# EAGLE design Alim-5-12vcc (EAGLE 7.2.0)
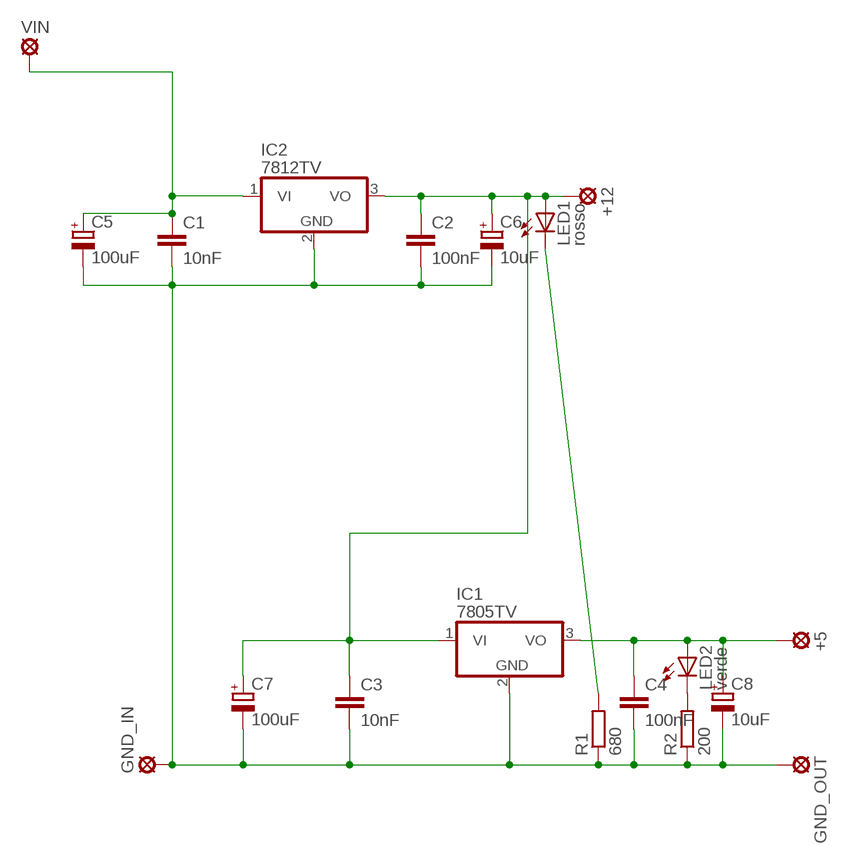
[diagram p0: schematic, sheet 1]

## Parts
+5  SE14  [SE14]
+12  SE14  [SE14]
C1  10nF  C-EU050-025X075  [C050-025X075]
C2  100nF  C-EU050-025X075  [C050-025X075]
C3  10nF  C-EU050-025X075  [C050-025X075]
C4  100nF  C-EU050-025X075  [C050-025X075]
C5  100uF  CPOL-EUE2.5-6  [E2,5-6]
C6  10uF  CPOL-EUE2.5-6  [E2,5-6]
C7  100uF  CPOL-EUE2.5-6  [E2,5-6]
C8  10uF  CPOL-EUE2.5-6  [E2,5-6]
GND_IN  SE14  [SE14]
GND_OUT  SE14  [SE14]
IC1  7805TV  [TO220V]
IC2  7812TV  [TO220V]
LED1  rosso  LED5MM  [LED5MM]
LED2  verde  LED5MM  [LED5MM]
R1  680  R-EU_0204/7  [0204/7]
R2  200  R-EU_0204/7  [0204/7]
VIN  SE14  [SE14]

## Nets
N$1: C1.1 C5.+ IC2.1(VI) VIN.MP
N$2: +12.MP C2.1 C3.1 C6.+ C7.+ IC1.1(VI) IC2.3(VO) LED1.A
N$3: C1.2 C2.2 C3.2 C4.2 C5.- C6.- C7.- C8.- GND_IN.MP GND_OUT.MP IC1.2(GND) IC2.2(GND) R1.1 R2.1
N$4: LED1.K(C) R1.2
N$5: +5.MP C4.1 C8.+ IC1.3(VO) LED2.A
N$6: LED2.K(C) R2.2

## Library data of the parts
+5 +12 GND_IN GND_OUT VIN = solpad:SE14: SOLDER PAD E1553, drill 1,4mm, distributor Buerklin, 07F820
C1-C4 = resistor:C-EU: CAPACITOR, European symbol
C5-C8 = resistor:CPOL-EU: POLARIZED CAPACITOR, European symbol
IC1 IC2 = linear:78*: Positive VOLTAGE REGULATOR Source: http://cache.national.com/ds/LM/LM78L05.pdf http://www.fairchildsemi.com/ds/LM/LM7805.pdf
LED1 LED2 = led:LED: LED OSRAM: - CHIPLED LG R971, LG N971, LY N971, LG Q971, LY Q971, LO R971, LY R971 LH N974, LH R974 LS Q976, LO Q976, LY Q976 LO Q996 - Hyper CHIPLED LW Q18S LB Q993, LB Q99A, LB R99A - SideLED LS A670, LO A670, LY A670, LG A670, LP A670 LB A673, LV A673, LT A673, LW A673 LH A674 LY A675 LS A676, LA A676, LO A676, LY A676, LW A676 LS A679, LY A679, LG A679 - Hyper Micro SIDELED® LS Y876, LA Y876, LO Y876, LY Y876 LT Y87S - SmartLED LW L88C, LW L88S LB L89C, LB L89S, LG L890 LS L89K, LO L89K, LY L89K LS L896, LA L896, LO L896, LY L896 - TOPLED LS T670, LO T670, LY T670, LG T670, LP T670 LSG T670, LSP T670, LSY T670, LOP T670, LYG T670 LG T671, LOG T671, LSG T671 LB T673, LV T673, LT T673, LW T673 LH T674 LS T676, LA T676, LO T676, LY T676, LB T676, LH T676, LSB T676, LW T676 LB T67C, LV T67C, LT T67C, LS T67K, LO T67K, LY T67K, LW E67C LS E67B, LA E67B, LO E67B, LY E67B, LB E67C, LV E67C, LT E67C LW T67C LS T679, LY T679, LG T679 LS T770, LO T770, LY T770, LG T770, LP T770 LB T773, LV T773, LT T773, LW T773 LH T774 LS E675, LA E675, LY E675, LS T675 LS T776, LA T776, LO T776, LY T776, LB T776 LHGB T686 LT T68C, LB T68C - Hyper Mini TOPLED® LB M676 - Mini TOPLED Santana® LG M470 LS M47K, LO M47K, LY M47K Source: http://www.osram.convergy.de LUXEON: - LUMILED® LXK2-PW12-R00, LXK2-PW12-S00, LXK2-PW14-U00, LXK2-PW14-V00 LXK2-PM12-R00, LXK2-PM12-S00, LXK2-PM14-U00 LXK2-PE12-Q00, LXK2-PE12-R00, LXK2-PE12-S00, LXK2-PE14-T00, LXK2-PE14-U00 LXK2-PB12-K00, LXK2-PB12-L00, LXK2-PB12-M00, LXK2-PB14-N00, LXK2-PB14-P00, LXK2-PB14-Q00 LXK2-PR12-L00, LXK2-PR12-M00, LXK2-PR14-Q00, LXK2-PR14-R00 LXK2-PD12-Q00, LXK2-PD12-R00, LXK2-PD12-S00 LXK2-PH12-R00, LXK2-PH12-S00 LXK2-PL12-P00, LXK2-PL12-Q00, LXK2-PL12-R00 Source: www.luxeon.com KINGBRIGHT: KA-3528ASYC Source: www.kingbright.com
R1 R2 = resistor:R-EU_: RESISTOR, European symbol

## Board
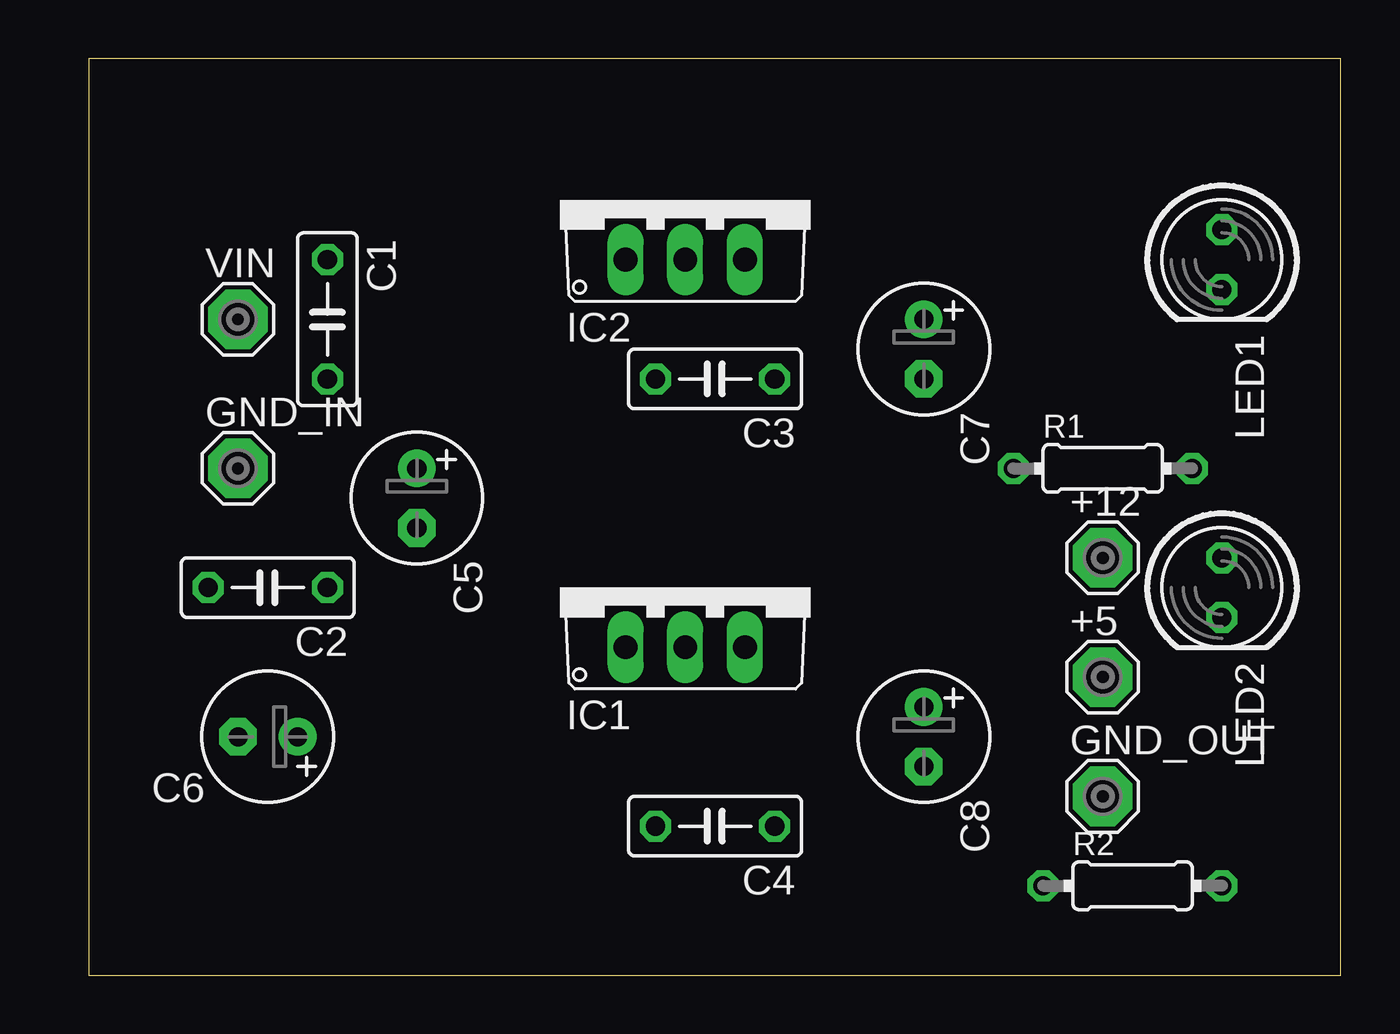
[diagram p1: board, top side]
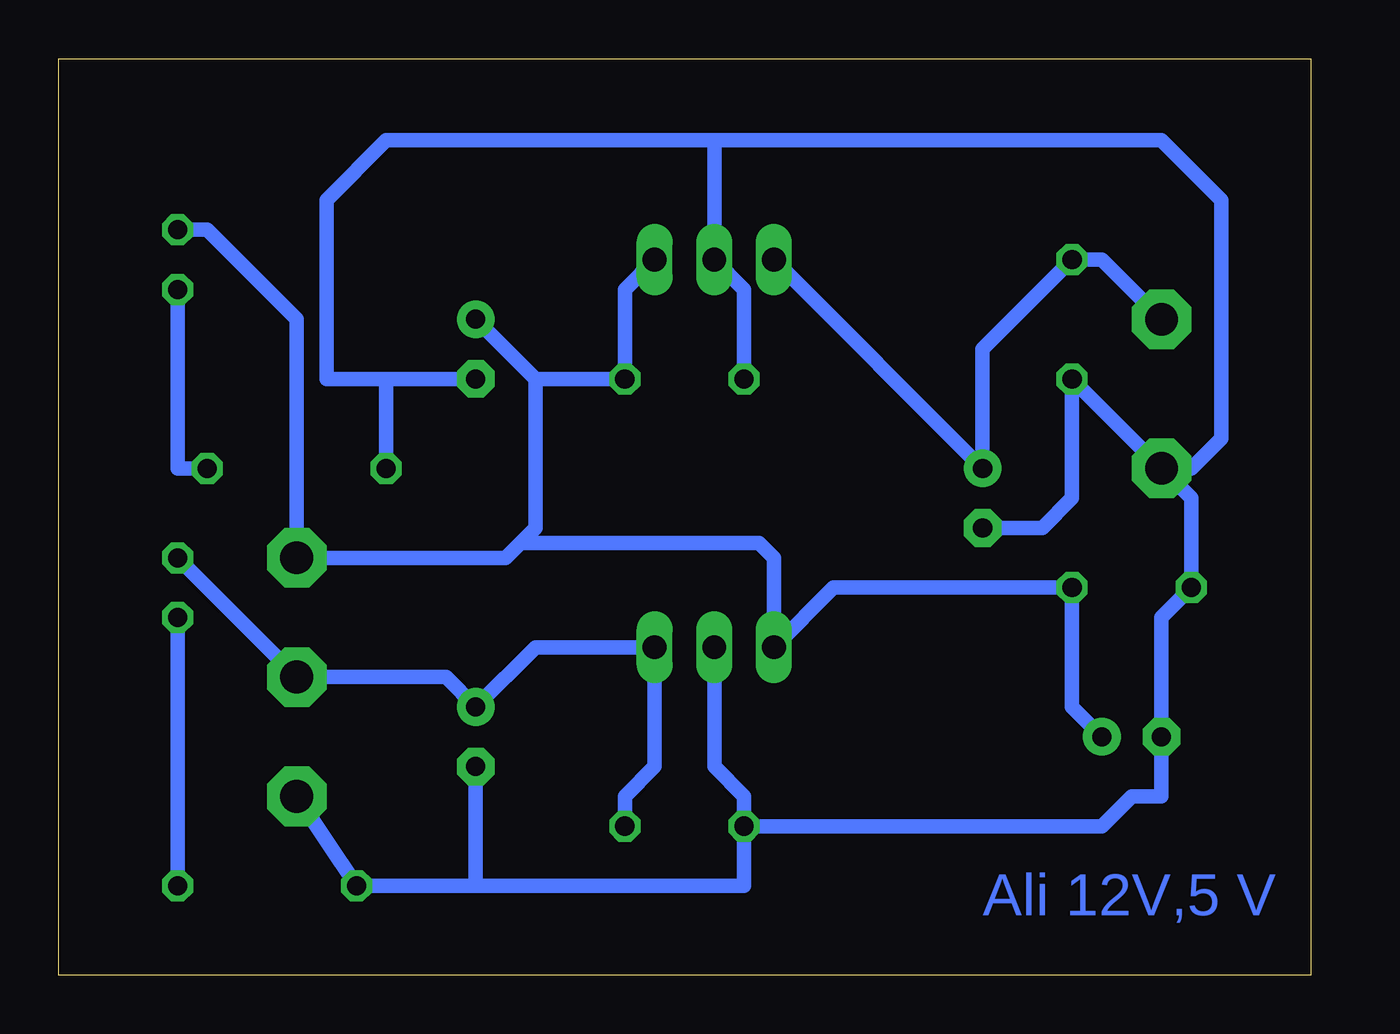
[diagram p2: board, bottom side, seen from below]

Size 53.32 x 39.04 mm. Coordinates in mm from the lower left corner, seen from the top.
Outline: 0,0 53.32,0 53.32,39.04 0,39.04 0,0
Copper layers (1*16): Top 0.035mm / dielectric 1.5mm / Bottom 0.035mm
Design rules "default": minimum track width 10mil, minimum drill 24mil, track to track 8mil, track to pad 8mil, pad to pad 8mil, via to via 8mil, smd to smd 8mil, copper to edge 40mil, drill to drill 8mil, minimum pad ring 10mil, minimum via ring 8mil, stop-mask expansion 4mil, vias tented up to drill 0mil, thermal gap 10mil

### Footprints (pad centres in the part's own frame; a part is rotated, then mirrored left to right if it is on the bottom)
SE14 = drill 1.397 pad 2.54 octagon: MP 0,0
C050-025X075 = drill 0.813 octagon: 1 -2.54,0; 2 2.54,0
E2,5-6 = drill 0.813 pad 1.6: + -1.27,0 | drill 0.813 pad 1.6 octagon: - 1.27,0
TO220V = drill 1.016 long: 1 -2.54,-2.54; 2 0,-2.54; 3 2.54,-2.54
LED5MM = drill 0.813 octagon: A -1.27,0; K 1.27,0
0204/7 = drill 0.813 octagon: 1 -3.81,0; 2 3.81,0

### Placement (x,y rotation side)
+5  43.18,12.7 0 top
+12  43.18,17.78 0 top
C1  10.16,27.94 270 top
C2  7.62,16.51 180 top
C3  26.67,25.4 180 top
C4  26.67,6.35 180 top
C5  13.97,20.32 270 top
C6  7.62,10.16 180 top
C7  35.56,26.67 270 top
C8  35.56,10.16 270 top
GND_IN  6.35,21.59 0 top
GND_OUT  43.18,7.62 0 top
IC1  25.4,16.51 0 top
IC2  25.4,33.02 0 top
LED1  48.26,30.48 270 top
LED2  48.26,16.51 270 top
R1  43.18,21.59 0 top
R2  44.45,3.81 0 top
VIN  6.35,27.94 0 top

### Tracks (layer width: path | path; a pad name or v marks a point on that pad's centre or on a via)
N$1
  Bottom 0.61: VIN.MP 8.89,30.48 C1.1 13.97,26.67 C5.+ IC2.1
N$2
  Bottom 0.61: C7.+ 33.02,25.4 | 33.02,25.4 33.02,19.05 33.66,18.41 | 33.66,18.41 34.29,17.78 +12.MP 43.18,27.94 46.99,31.75 LED1.A | C6.+ 10.16,11.43 C2.1 20.32,16.51 IC1.1 22.86,17.78 23.5,18.41 33.66,18.41 | IC2.3 29.21,29.21 C3.1 33.02,25.4
N$3
  Bottom 0.61: GND_IN.MP 5.08,20.32 C2.2 6.35,15.24 C6.- 6.35,7.62 7.62,7.62 8.89,6.35 C4.2 | GND_OUT.MP R2.1 35.56,3.81 | 35.56,3.81 C8.- | C4.2 24.13,3.81 35.56,3.81 | GND_IN.MP C1.2 10.16,20.32 11.43,19.05 C5.- | 25.4,35.56 6.35,35.56 3.81,33.02 3.81,22.86 5.08,21.59 GND_IN.MP | 25.4,35.56 IC2.2 24.13,29.21 C3.2 | 25.4,35.56 39.37,35.56 41.91,33.02 41.91,25.4 39.37,25.4 | 39.37,25.4 C7.- | IC1.2 25.4,8.89 24.13,7.62 C4.2 | R1.1 39.37,25.4
N$4
  Bottom 0.61: LED1.K 48.26,21.59 R1.2
N$5
  Bottom 0.61: C4.1 29.21,7.62 27.94,8.89 IC1.3 33.02,13.97 C8.+ 36.83,12.7 +5.MP LED2.A
N$6
  Bottom 0.61: LED2.K R2.2

### Text on the board
Bottom: Ali 12V,5 V